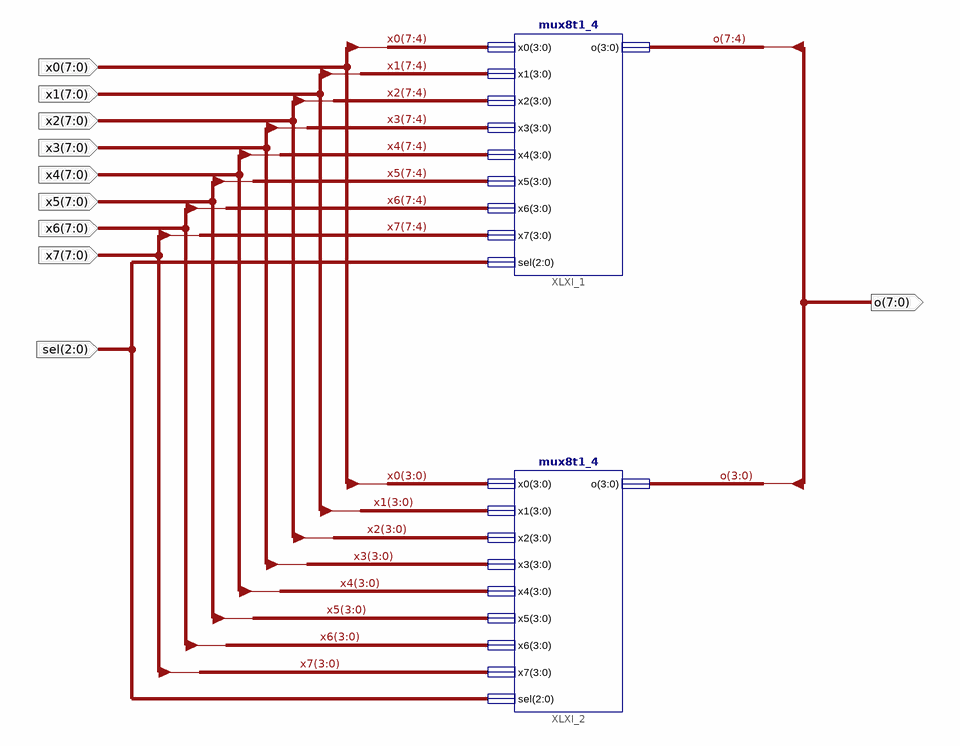
[diagram p0: schematic sheet 1]
// Xilinx ISE schematic mux8t1_8.sch (kintex7) as structural Verilog: 2 symbols, 10 ports
module mux8t1_8 (
  input  [7:0] x0,
  input  [7:0] x1,
  input  [7:0] x2,
  input  [7:0] x3,
  input  [7:0] x4,
  input  [7:0] x5,
  input  [7:0] x6,
  input  [7:0] x7,
  input  [2:0] sel,
  output [7:0] o
);

  mux8t1_4 XLXI_1 (
    .x0(x0[7:4]), .x1(x1[7:4]), .x2(x2[7:4]), .x3(x3[7:4]), .x4(x4[7:4]), .x5(x5[7:4]), .x6(x6[7:4]),
    .x7(x7[7:4]), .sel(sel), .o(o[7:4]));
  mux8t1_4 XLXI_2 (
    .x0(x0[3:0]), .x1(x1[3:0]), .x2(x2[3:0]), .x3(x3[3:0]), .x4(x4[3:0]), .x5(x5[3:0]), .x6(x6[3:0]),
    .x7(x7[3:0]), .sel(sel), .o(o[3:0]));
endmodule
